# EAGLE design pcb-bldc-drive-triple (EAGLE 9.6.2)
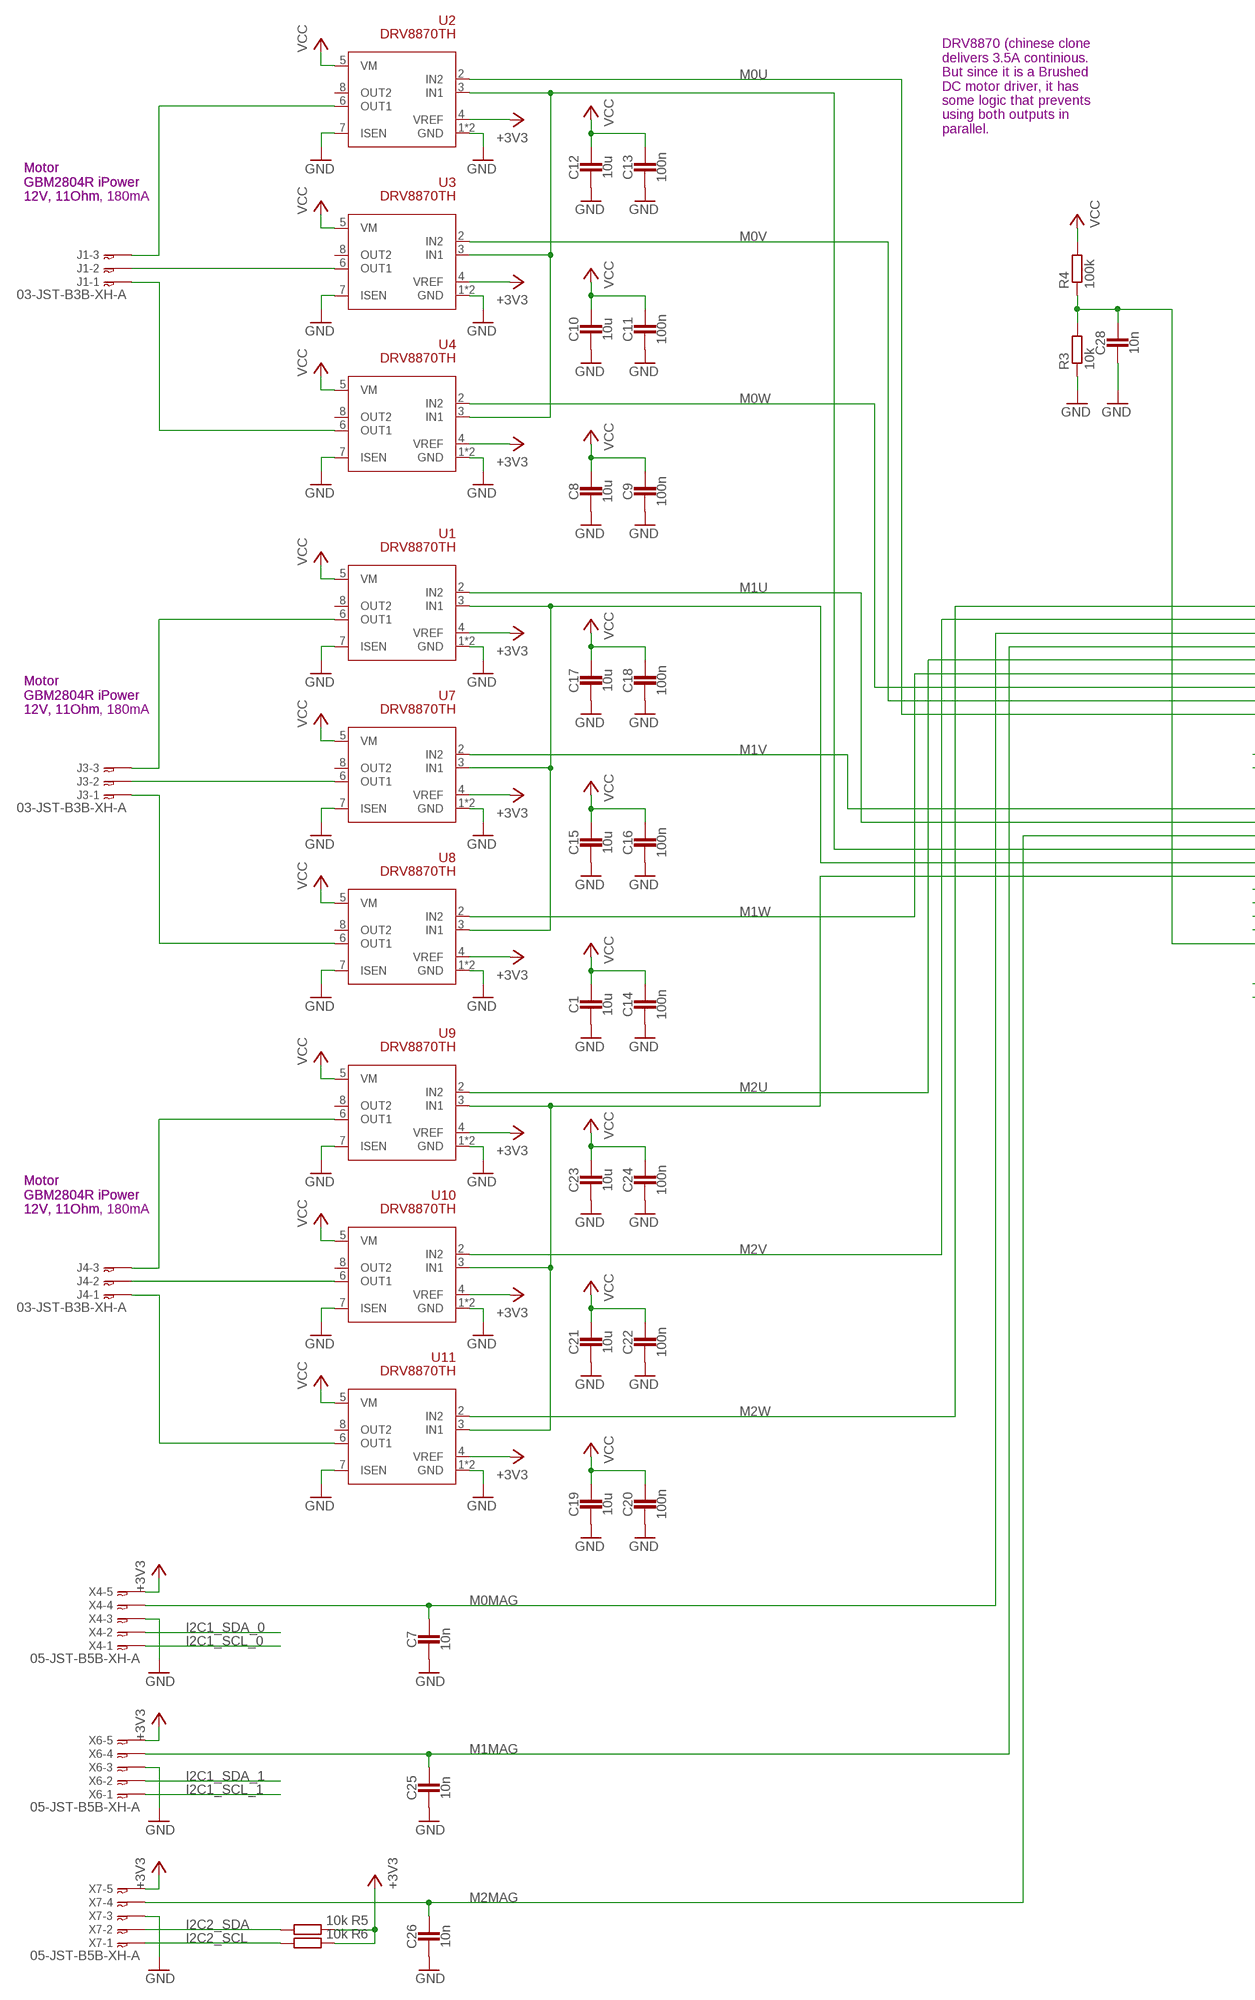
[diagram p0: schematic, sheet 1, part 1 of 2]
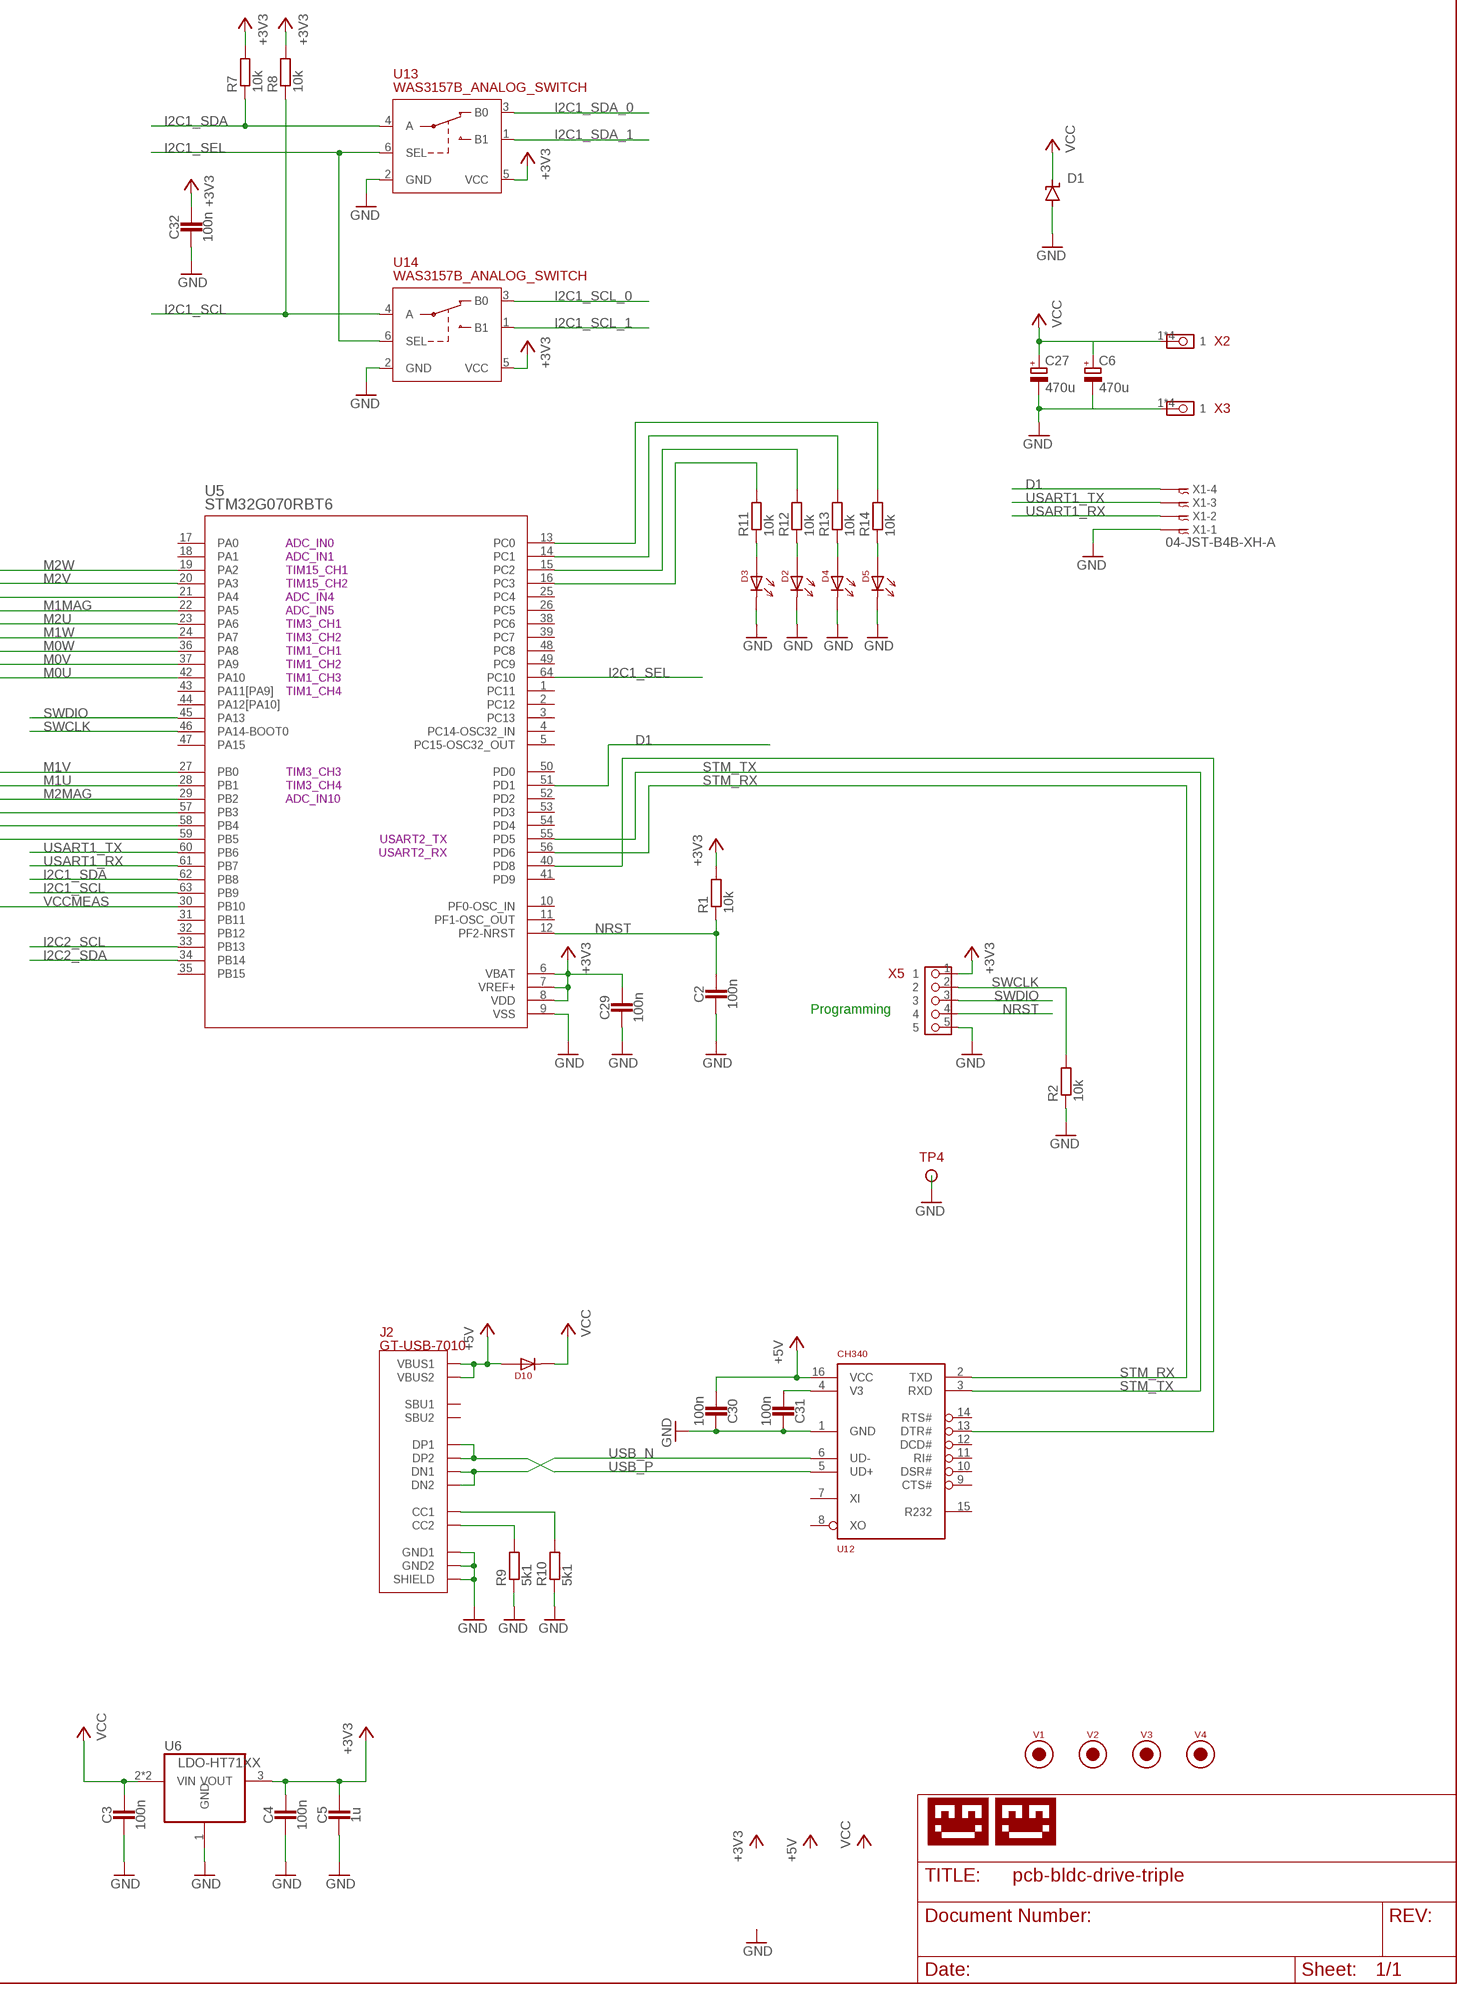
[diagram p1: schematic, sheet 1, part 2 of 2]

## Parts
C1  10u  CAPACITOR1206_CAP  [1206_CAP]
C2  100n  CAPACITOR0603_CAP  [0603_CAP]
C3  100n  CAPACITOR0603_CAP  [0603_CAP]
C4  100n  CAPACITOR0603_CAP  [0603_CAP]
C5  1u  CAPACITOR0603_CAP  [0603_CAP]
C6  470u  CPOL-EU153CLV-1010  [153CLV-1010]
C7  10n  CAPACITOR0603_CAP  [0603_CAP]
C8  10u  CAPACITOR1206_CAP  [1206_CAP]
C9  100n  CAPACITOR0603_CAP  [0603_CAP]
C10  10u  CAPACITOR1206_CAP  [1206_CAP]
C11  100n  CAPACITOR0603_CAP  [0603_CAP]
C12  10u  CAPACITOR1206_CAP  [1206_CAP]
C13  100n  CAPACITOR0603_CAP  [0603_CAP]
C14  100n  CAPACITOR0603_CAP  [0603_CAP]
C15  10u  CAPACITOR1206_CAP  [1206_CAP]
C16  100n  CAPACITOR0603_CAP  [0603_CAP]
C17  10u  CAPACITOR1206_CAP  [1206_CAP]
C18  100n  CAPACITOR0603_CAP  [0603_CAP]
C19  10u  CAPACITOR1206_CAP  [1206_CAP]
C20  100n  CAPACITOR0603_CAP  [0603_CAP]
C21  10u  CAPACITOR1206_CAP  [1206_CAP]
C22  100n  CAPACITOR0603_CAP  [0603_CAP]
C23  10u  CAPACITOR1206_CAP  [1206_CAP]
C24  100n  CAPACITOR0603_CAP  [0603_CAP]
C25  10n  CAPACITOR0603_CAP  [0603_CAP]
C26  10n  CAPACITOR0603_CAP  [0603_CAP]
C27  470u  CPOL-EU153CLV-1010  [153CLV-1010]
C28  10n  CAPACITOR0603_CAP  [0603_CAP]
C29  100n  CAPACITOR0603_CAP  [0603_CAP]
C30  100n  CAPACITOR0603_CAP  [0603_CAP]
C31  100n  CAPACITOR0603_CAP  [0603_CAP]
C32  100n  CAPACITOR0603_CAP  [0603_CAP]
D1  SUPPRESSOR-SMBJ  [SMBJ]
D2  LED-0805  [0805-DOT]
D3  LED-0805  [0805-DOT]
D4  LED-0805  [0805-DOT]
D5  LED-0805  [0805-DOT]
D10  DIODE-1206  [1206-DOT]
J1  03-JST-B3B-XH-A  [B3B-XH]
J2  GT-USB-7010  [GT-USB-7010]
J3  03-JST-B3B-XH-A  [B3B-XH]
J4  03-JST-B3B-XH-A  [B3B-XH]
R1  10k  RESISTOR0603_RES  [0603-RES]
R2  10k  RESISTOR0603_RES  [0603-RES]
R3  10k  RESISTOR0603_RES  [0603-RES]
R4  100k  RESISTOR0603_RES  [0603-RES]
R5  10k  RESISTOR0603_RES  [0603-RES]
R6  10k  RESISTOR0603_RES  [0603-RES]
R7  10k  RESISTOR0603_RES  [0603-RES]
R8  10k  RESISTOR0603_RES  [0603-RES]
R9  5k1  RESISTOR0603_RES  [0603-RES]
R10  5k1  RESISTOR0603_RES  [0603-RES]
R11  10k  RESISTOR0603_RES  [0603-RES]
R12  10k  RESISTOR0603_RES  [0603-RES]
R13  10k  RESISTOR0603_RES  [0603-RES]
R14  10k  RESISTOR0603_RES  [0603-RES]
TP4  TESTPIN1MM  [PIN-SMD-1X1-TEST_1M0]
U1  DRV8870TH  [SOIC-8-THERM]
U2  DRV8870TH  [SOIC-8-THERM]
U3  DRV8870TH  [SOIC-8-THERM]
U4  DRV8870TH  [SOIC-8-THERM]
U5  STM32G070RBT6  [LQFP-64]
U6  LDO-HT71XX  [SOT-89]
U7  DRV8870TH  [SOIC-8-THERM]
U8  DRV8870TH  [SOIC-8-THERM]
U9  DRV8870TH  [SOIC-8-THERM]
U10  DRV8870TH  [SOIC-8-THERM]
U11  DRV8870TH  [SOIC-8-THERM]
U12  CH340  [SOIC-16]
U13  WAS3157B_ANALOG_SWITCH  [SOT323-6]
U14  WAS3157B_ANALOG_SWITCH  [SOT323-6]
U$1  LOGO-TOBENG-1MM-FINISH  [TOBENG-1MM-FINISH]
U$2  LOGO-TOBENG-4MM-MASK  [TOBENG-4MM-MASK]
V1  FIDUCIAL2MM  [FIDUCIAL_2MM]
V2  FIDUCIAL2MM  [FIDUCIAL_2MM]
V3  FIDUCIAL2MM  [FIDUCIAL_2MM]
V4  FIDUCIAL2MM  [FIDUCIAL_2MM]
X1  04-JST-B4B-XH-A  [B4B-XH]
X2  PIN_1X1WELDINGTERMINAL  [XFCNTS34031]
X3  PIN_1X1WELDINGTERMINAL  [XFCNTS34031]
X4  05-JST-B5B-XH-A  [B5B-XH]
X5  PIN_5X1HD  [PIN_5X1_HD]
X6  05-JST-B5B-XH-A  [B5B-XH]
X7  05-JST-B5B-XH-A  [B5B-XH]

## Nets
+3V3: C4.1 C5.1 C29.1 C32.1 R1.2 R5.1 R6.1 R7.2 R8.2 U1.4(VREF) U2.4(VREF) U3.4(VREF) U4.4(VREF) U5.6(VBAT) U5.7(VREF+) U5.8(VDD) U6.3(VOUT) U7.4(VREF) U8.4(VREF) U9.4(VREF) U10.4(VREF) U11.4(VREF) U13.5(VCC) U14.5(VCC) X4.P$5 X5.1 X6.P$5 X7.P$5
+5V: C30.2 D10.1 J2.A4B9(VBUS1) J2.B4A9(VBUS2) U12.16(VCC)
D1: U5.51(PD1) X1.P$4
GND: C1.2 C2.2 C3.2 C4.2 C5.2 C6.- C7.2 C8.2 C9.2 C10.2 C11.2 C12.2 C13.2 C14.2 C15.2 C16.2 C17.2 C18.2 C19.2 C20.2 C21.2 C22.2 C23.2 C24.2 C25.2 C26.2 C27.- C28.2 C29.2 C30.1 C31.1 C32.2 D1.A D2.2 D3.2 D4.2 D5.2 J2.13(SHIELD) J2.14(SHIELD) J2.15(SHIELD) J2.16(SHIELD) J2.A1B12(GND1) J2.B1A12(GND2) R2.1 R3.1 R9.1 R10.1 TP4.1 U1.1(GND) U1.7(ISEN) U1.9(GND) U2.1(GND) U2.7(ISEN) U2.9(GND) U3.1(GND) U3.7(ISEN) U3.9(GND) U4.1(GND) U4.7(ISEN) U4.9(GND) U5.9(VSS) U6.1(GND) U7.1(GND) U7.7(ISEN) U7.9(GND) U8.1(GND) U8.7(ISEN) U8.9(GND) U9.1(GND) U9.7(ISEN) U9.9(GND) U10.1(GND) U10.7(ISEN) U10.9(GND) U11.1(GND) U11.7(ISEN) U11.9(GND) U12.1(GND) U13.2(GND) U14.2(GND) X1.P$1 X3.1 X3.2 X3.3 X3.4 X4.P$3 X5.5 X6.P$3 X7.P$3
I2C1_SCL: R8.1 U5.63(PB9) U14.4(A)
I2C1_SCL_0: U14.3(B0) X4.P$1
I2C1_SCL_1: U14.1(B1) X6.P$1
I2C1_SDA: R7.1 U5.62(PB8) U13.4(A)
I2C1_SDA_0: U13.3(B0) X4.P$2
I2C1_SDA_1: U13.1(B1) X6.P$2
I2C1_SEL: U5.64(PC10) U13.6(SEL) U14.6(SEL)
I2C2_SCL: R6.2 U5.33(PB13) X7.P$1
I2C2_SDA: R5.2 U5.34(PB14) X7.P$2
M0MAG: C7.1 U5.21(PA4) X4.P$4
M0U: U2.2(IN2) U5.42(PA10)
M0V: U3.2(IN2) U5.37(PA9)
M0W: U4.2(IN2) U5.36(PA8)
M1MAG: C25.1 U5.22(PA5) X6.P$4
M1U: U1.2(IN2) U5.28(PB1)
M1V: U5.27(PB0) U7.2(IN2)
M1W: U5.24(PA7) U8.2(IN2)
M2MAG: C26.1 U5.29(PB2) X7.P$4
M2U: U5.23(PA6) U9.2(IN2)
M2V: U5.20(PA3) U10.2(IN2)
M2W: U5.19(PA2) U11.2(IN2)
N$1: J2.B5(CC2) R9.2
N$2: J2.A5(CC1) R10.2
N$3 [power]: J1.P$2 U3.6(OUT1)
N$4 [power]: J1.P$3 U2.6(OUT1)
N$5: C31.2 U12.4(V3)
N$6 [power]: J3.P$3 U1.6(OUT1)
N$7 [power]: J1.P$1 U4.6(OUT1)
N$8: D3.1 R11.1
N$9 [power]: J3.P$2 U7.6(OUT1)
N$10 [power]: J3.P$1 U8.6(OUT1)
N$11: U5.59(PB5) U9.3(IN1) U10.3(IN1) U11.3(IN1)
N$12: U1.3(IN1) U5.58(PB4) U7.3(IN1) U8.3(IN1)
N$13 [power]: J4.P$3 U9.6(OUT1)
N$14: U2.3(IN1) U3.3(IN1) U4.3(IN1) U5.57(PB3)
N$15 [power]: J4.P$2 U10.6(OUT1)
N$16 [power]: J4.P$1 U11.6(OUT1)
N$17: D2.1 R12.1
N$18: D4.1 R13.1
N$19: D5.1 R14.1
N$20: R14.2 U5.13(PC0)
N$21: R13.2 U5.14(PC1)
N$22: R12.2 U5.15(PC2)
N$23: R11.2 U5.16(PC3)
N$74: U5.40(PD8) U12.13(DTR#)
NRST: C2.1 R1.1 U5.12(PF2-NRST) X5.4
STM_RX: U5.56(PD6) U12.2(TXD)
STM_TX: U5.55(PD5) U12.3(RXD)
SWCLK: R2.2 U5.46(PA14-BOOT0) X5.2
SWDIO: U5.45(PA13) X5.3
USART1_RX: U5.61(PB7) X1.P$2
USART1_TX: U5.60(PB6) X1.P$3
USB_N [usb]: J2.A7(DN1) J2.B7(DN2) U12.6(UD-)
USB_P [usb]: J2.A6(DP1) J2.B6(DP2) U12.5(UD+)
VCC [power]: C1.1 C3.1 C6.+ C8.1 C9.1 C10.1 C11.1 C12.1 C13.1 C14.1 C15.1 C16.1 C17.1 C18.1 C19.1 C20.1 C21.1 C22.1 C23.1 C24.1 C27.+ D1.C D10.2 R4.2 U1.5(VM) U2.5(VM) U3.5(VM) U4.5(VM) U6.2(VIN) U6.2@1(VIN) U7.5(VM) U8.5(VM) U9.5(VM) U10.5(VM) U11.5(VM) X2.1 X2.2 X2.3 X2.4
VCCMEAS: C28.1 R3.2 R4.1 U5.30(PB10)
Unconnected: J2.A8(SBU1) J2.B8(SBU2) U1.8(OUT2) U2.8(OUT2) U3.8(OUT2) U4.8(OUT2) U5.1(PC11) U5.2(PC12) U5.3(PC13) U5.4(PC14-OSC32_IN) U5.5(PC15-OSC32_OUT) U5.10(PF0-OSC_IN) U5.11(PF1-OSC_OUT) U5.17(PA0) U5.18(PA1) U5.25(PC4) U5.26(PC5) U5.31(PB11) U5.32(PB12) U5.35(PB15) U5.38(PC6) U5.39(PC7) U5.41(PD9) U5.43(PA11[PA9]) U5.44(PA12[PA10]) U5.47(PA15) U5.48(PC8) U5.49(PC9) U5.50(PD0) U5.52(PD2) U5.53(PD3) U5.54(PD4) U7.8(OUT2) U8.8(OUT2) U9.8(OUT2) U10.8(OUT2) U11.8(OUT2) U12.7(XI) U12.8(XO) U12.9(CTS#) U12.10(DSR#) U12.11(RI#) U12.12(DCD#) U12.14(RTS#) U12.15(R232)

## Notes on the sheet
- DRV8870 (chinese clone
  delivers 3.5A continious.
  But since it is a Brushed
  DC motor driver, it has
  some logic that prevents
  using both outputs in 
  parallel.
- Motor
  GBM2804R iPower
  12V, 11Ohm
- Motor
  GBM2804R iPower
  12V, 11Ohm, 180mA
- ADC_IN0
- ADC_IN1
- TIM15_CH1
- TIM15_CH2
- ADC_IN4
- ADC_IN5
- TIM3_CH1
- TIM3_CH2
- TIM1_CH1
- TIM1_CH2
- Motor
  GBM2804R iPower
  12V, 11Ohm
- Motor
  GBM2804R iPower
  12V, 11Ohm, 180mA
- TIM1_CH3
- TIM1_CH4
- TIM3_CH3
- TIM3_CH4
- ADC_IN10
- USART2_TX
- USART2_RX
- Programming
- Motor
  GBM2804R iPower
  12V, 11Ohm
- Motor
  GBM2804R iPower
  12V, 11Ohm, 180mA

## Library data of the parts
C1-C5 C7-C26 C28-C32 = passives:CAPACITOR: SMD Capacitor
C6 C27 = resistor:CPOL-EU: POLARIZED CAPACITOR, European symbol
D1 = diode:SUPPRESSOR-: Suppressor diode
D2-D5 = ftobler:LED
D10 = ftobler:DIODE
J1 J3 J4 = bt_con-jst-xh:03-JST: JST CONNECTOR
J2 = ftobler:GT-USB-7010
R1-R14 = passives:RESISTOR: Resistor Basic schematic elements and footprints for 0201, 0402, 0603, 1206, and PTH resistors.
TP4 = ftobler_backup:TESTPIN
U1-U4 U7-U11 = ftobler:DRV8870
U5 = stm32:STM32G070RBT6; COPYRIGHT: Copyright (C) 2024 Ultra Librarian. All rights reserved.; MANUFACTURER_PART_NUMBER: STM32G070RBT6; MFR_NAME: STMicroelectronics
U6 = ftobler:LDO
U12 = ftobler:CH340
U13 U14 = ftobler:WAS3157B_ANALOG_SWITCH
U$1 U$2 = ftobler:LOGO
V1-V4 = ftobler - Copy:FIDUCIAL
X1 = bt_con-jst-xh:04-JST: JST CONNECTOR
X2 X3 = ftobler-conn:PIN_1X1
X4 X6 X7 = bt_con-jst-xh:05-JST: JST CONNECTOR
X5 = ftobler-conn:PIN_5X1

## Net classes
1 usb: width 0.18 mm, clearance 0.2 mm to class 0, clearance 0.15 mm
2 power: width 0.15 mm, clearance 0.2 mm to class 0, clearance 0.2 mm to class 1, clearance 0.2 mm

## Board
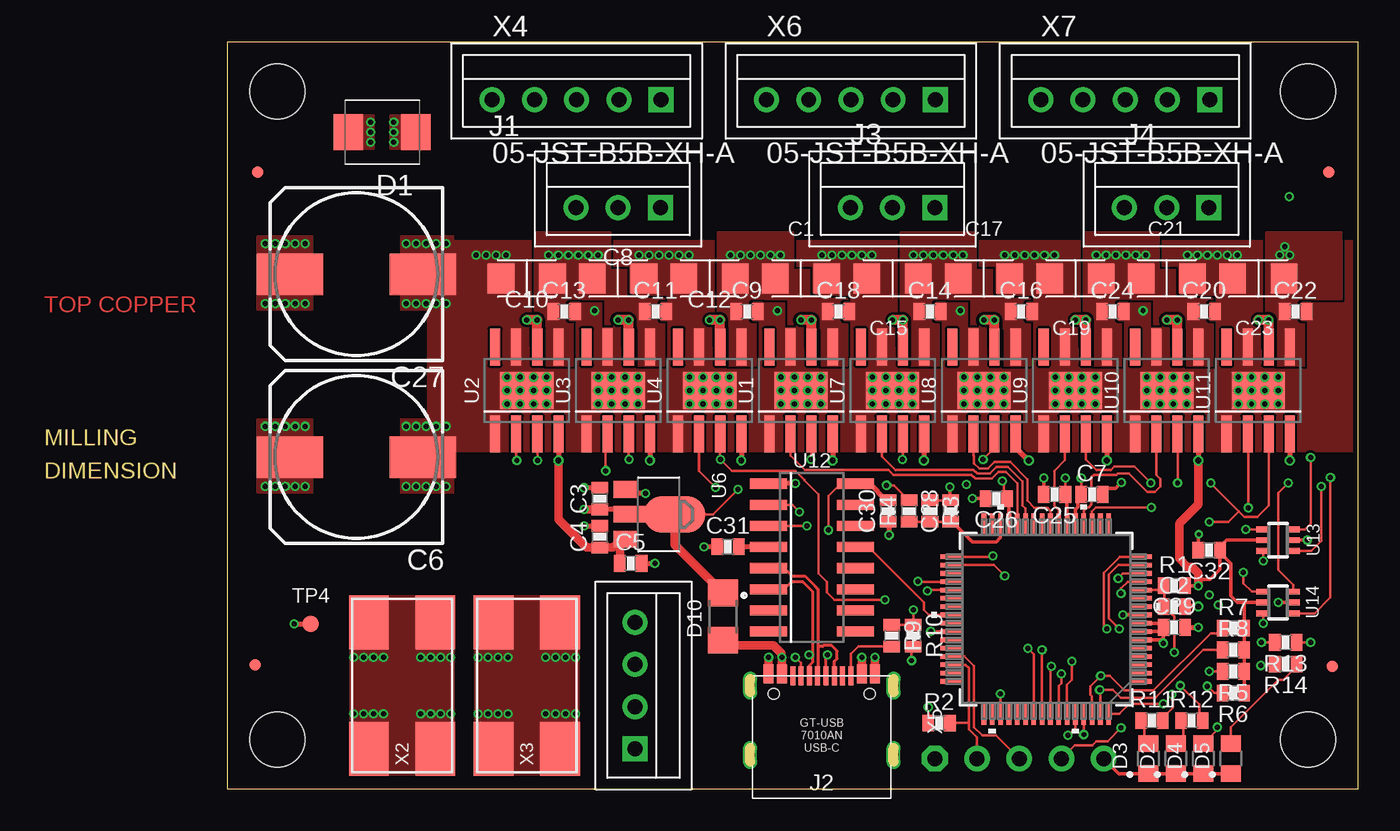
[diagram p2: board, top side]
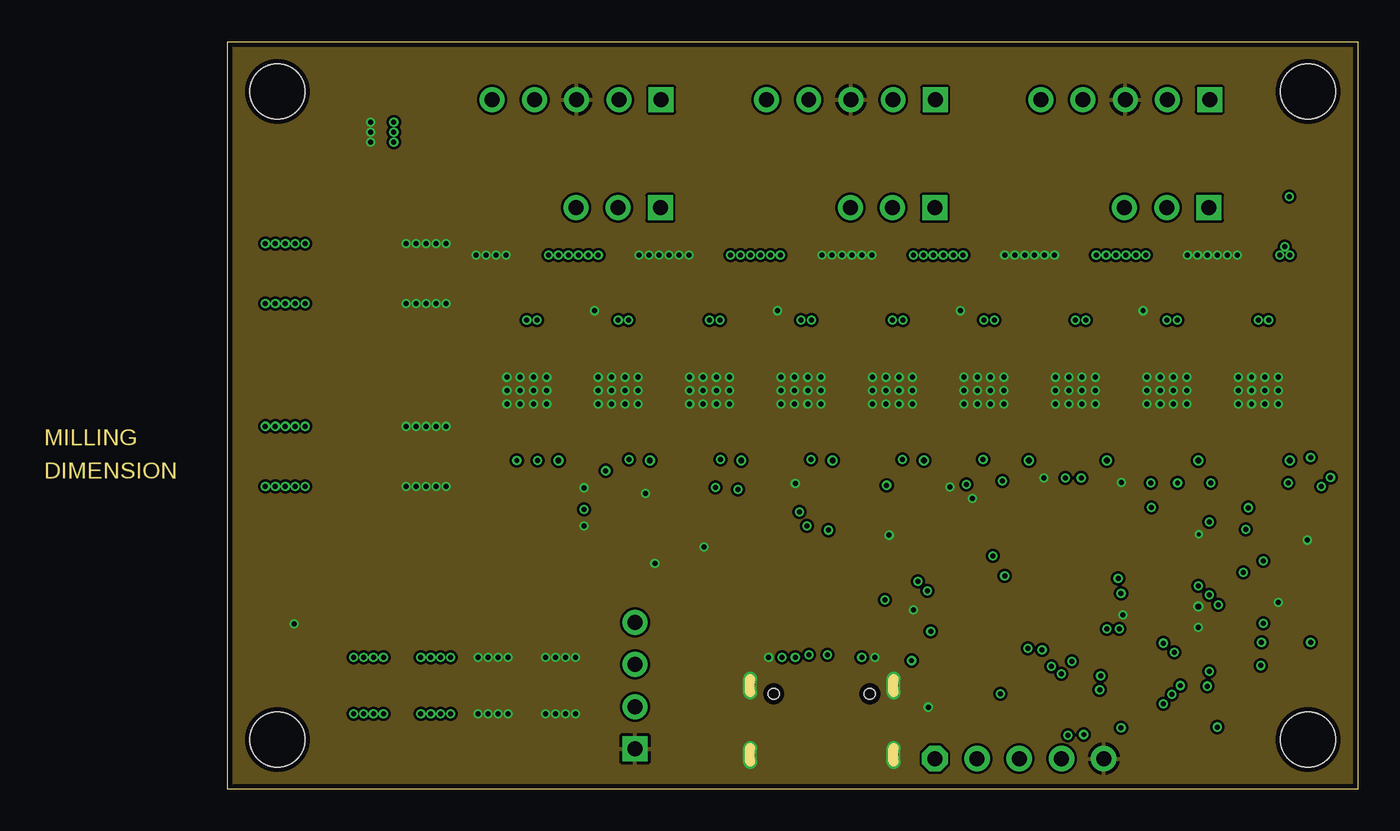
[diagram p3: board, inner layer Route2]
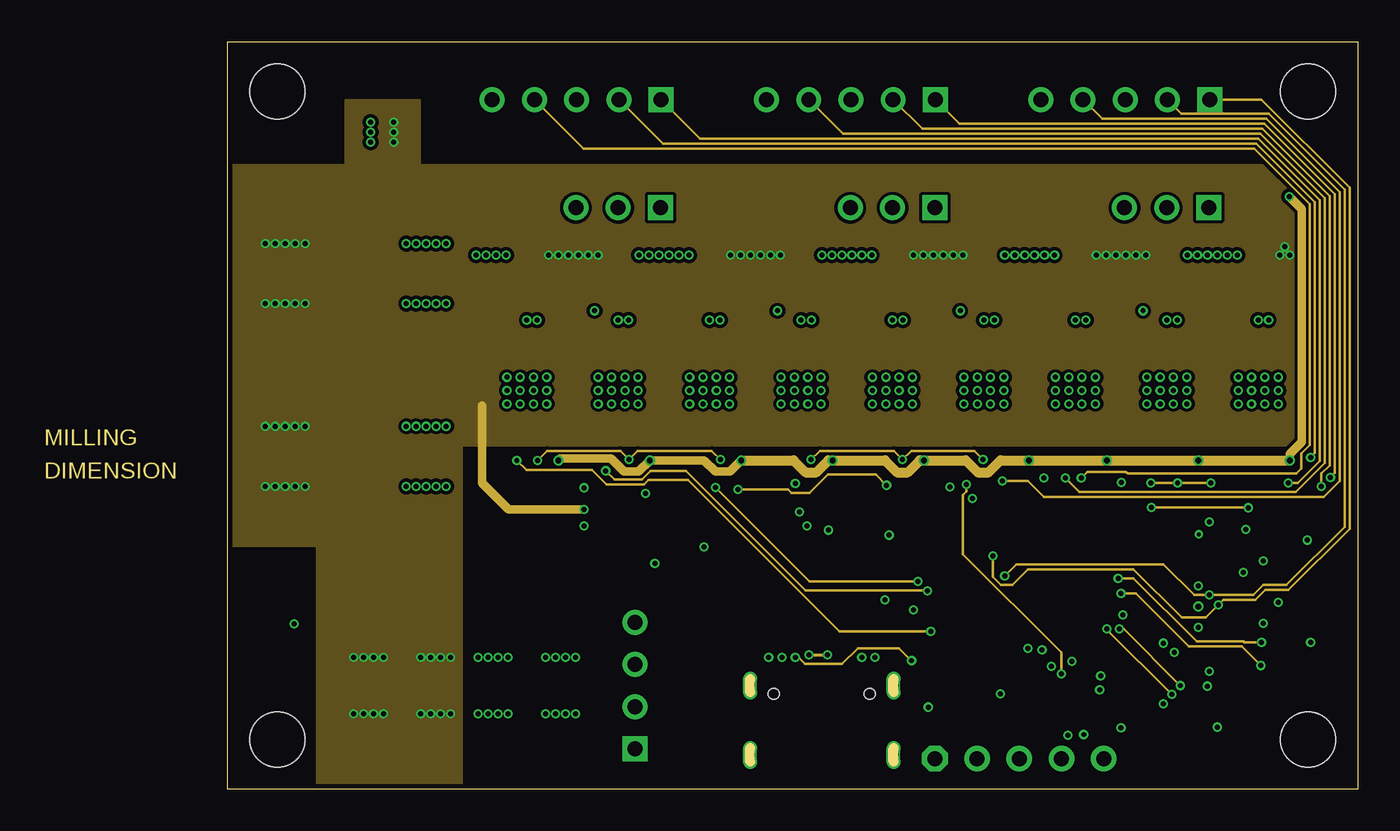
[diagram p4: board, inner layer Route15]
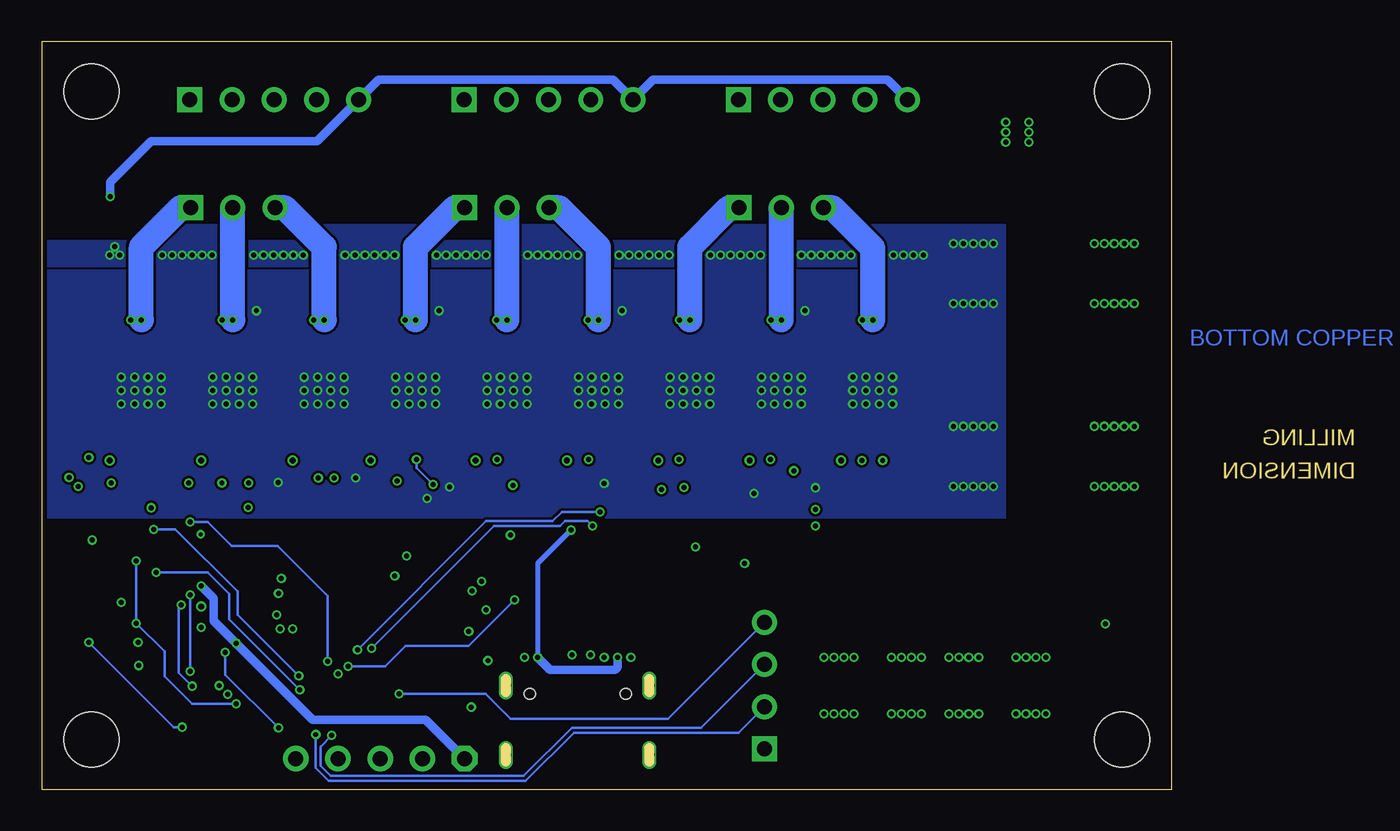
[diagram p5: board, bottom side, seen from below]

Size 68 x 45 mm. Coordinates in mm from the lower left corner, seen from the top.
Outline: 0,0 0,45 68,45 68,0 0,0
Copper layers (1+2*15+16): Top 0.035mm / dielectric 0.2mm / Route2 0.035mm / dielectric 0.4mm / Route15 0.035mm / dielectric 0.2mm / Bottom 0.035mm
Design rules "default *": minimum track width 0.15mm, minimum drill 0.2mm, track to track 0.15mm, track to pad 0.2mm, pad to pad 0.2mm, via to via 0.2mm, smd to smd 0.2mm, copper to edge 0.3mm, drill to drill 10mil, minimum pad ring 0.125mm, minimum via ring 0.125mm, stop-mask expansion 0.05mm, vias tented up to drill 0.35mm, thermal gap 0.2mm
Holes 3.3 mm at 3,42 65,42 65,3 3,3
tRestrict: area -0.3,38.7 to 6.3,45.3; area 61.7,38.7 to 68.3,45.3; area 61.7,-0.3 to 68.3,6.3; area -0.3,-0.3 to 6.3,6.3
bRestrict: area -0.3,38.7 to 6.3,45.3; area 61.7,38.7 to 68.3,45.3; area -0.3,-0.3 to 6.3,6.3; area 61.7,-0.3 to 68.3,6.3

### Footprints (pad centres in the part's own frame; a part is rotated, then mirrored left to right if it is on the bottom)
1206_CAP = smd 1.6 x 1.8: 1 -1.55,0; 2 1.55,0
0603_CAP = smd 0.7 x 1: 1 -0.65,0; 2 0.65,0
153CLV-1010 = smd 4 x 2.5: + 4,0; - -4,0
SMBJ = smd 1.78 x 2.16: A 2.04,0; C -2.03,0
0805-DOT = smd 1 x 1.2: 1 0.9,0; 2 -0.9,0
1206-DOT = smd 1.6 x 1.803: 1 -1.422,0; 2 1.422,0
B3B-XH = drill 0.9 pad 1.5 square: P$1 2.54,0 | drill 0.9 pad 1.5: P$2 0,0; P$3 -2.54,0
GT-USB-7010 = drill 0.6 pad 0.8 long: 13 -4.32,0; 14 -4.32,-4.18; 15 4.32,0; 16 4.32,-4.18 | smd 0.6 x 1.14: A1B12 -3.2,0.7; A4B9 -2.4,0.7; B1A12 3.2,0.7; B4A9 2.4,0.7 | smd 0.3 x 1.14: A5 -1.25,0.575; A6 -0.25,0.575; A7 0.25,0.575; A8 1.25,0.575; B5 1.75,0.575; B6 0.75,0.575; B7 -0.75,0.575; B8 -1.75,0.575 | hole 0.65: -2.89,-0.5; 2.89,-0.5
0603-RES = smd 0.7 x 1: 1 -0.65,0; 2 0.65,0
PIN-SMD-1X1-TEST_1M0 = smd 1 x 1: 1 0,0
SOIC-8-THERM = smd 0.61 x 2.21: 1 -1.905,-2.616; 2 -0.635,-2.616; 3 0.635,-2.616; 4 1.905,-2.616; 5 1.905,2.616; 6 0.635,2.616; 7 -0.635,2.616; 8 -1.905,2.616 | smd 3.2 x 2.2: 9 0,0
LQFP-64 = smd 1.302 x 0.279: 1 -5.706,3.75; 2 -5.706,3.25; 3 -5.706,2.75; 4 -5.706,2.25; 5 -5.706,1.75; 6 -5.706,1.25; 7 -5.706,0.75; 8 -5.706,0.25; 9 -5.706,-0.25; 10 -5.706,-0.75; 11 -5.706,-1.25; 12 -5.706,-1.75; 13 -5.706,-2.25; 14 -5.706,-2.75; 15 -5.706,-3.25; 16 -5.706,-3.75; 33 5.706,-3.75; 34 5.706,-3.25; 35 5.706,-2.75; 36 5.706,-2.25; 37 5.706,-1.75; 38 5.706,-1.25; 39 5.706,-0.75; 40 5.706,-0.25; 41 5.706,0.25; 42 5.706,0.75; 43 5.706,1.25; 44 5.706,1.75; 45 5.706,2.25; 46 5.706,2.75; 47 5.706,3.25; 48 5.706,3.75 | smd 0.279 x 1.302: 17 -3.75,-5.706; 18 -3.25,-5.706; 19 -2.75,-5.706; 20 -2.25,-5.706; 21 -1.75,-5.706; 22 -1.25,-5.706; 23 -0.75,-5.706; 24 -0.25,-5.706; 25 0.25,-5.706; 26 0.75,-5.706; 27 1.25,-5.706; 28 1.75,-5.706; 29 2.25,-5.706; 30 2.75,-5.706; 31 3.25,-5.706; 32 3.75,-5.706; 49 3.75,5.706; 50 3.25,5.706; 51 2.75,5.706; 52 2.25,5.706; 53 1.75,5.706; 54 1.25,5.706; 55 0.75,5.706; 56 0.25,5.706; 57 -0.25,5.706; 58 -0.75,5.706; 59 -1.25,5.706; 60 -1.75,5.706; 61 -2.25,5.706; 62 -2.75,5.706; 63 -3.25,5.706; 64 -3.75,5.706
SOT-89 = smd 1 x 1.5: 1 -1.499,-1.981; 3 1.499,-1.981 | smd 1 x 2: 2 0,-1.727 | smd 2.2 x 3.7: 2@1 0,0.94
SOIC-16 = smd 0.61 x 2.21: 1 -4.445,-2.616; 2 -3.175,-2.616; 3 -1.905,-2.616; 4 -0.635,-2.616; 5 0.635,-2.616; 6 1.905,-2.616; 7 3.175,-2.616; 8 4.445,-2.616; 9 4.445,2.616; 10 3.175,2.616; 11 1.905,2.616; 12 0.635,2.616; 13 -0.635,2.616; 14 -1.905,2.616; 15 -3.175,2.616; 16 -4.445,2.616
SOT323-6 = smd 0.35 x 0.8: 1 -0.65,-0.9; 2 0,-0.9; 3 0.65,-0.9; 4 0.65,0.9; 5 0,0.9; 6 -0.65,0.9
FIDUCIAL_2MM = smd 0.7 x 0.7: V 0,0
B4B-XH = drill 0.9 pad 1.5 square: P$1 3.81,0 | drill 0.9 pad 1.5: P$2 1.27,0; P$3 -1.27,0; P$4 -3.81,0
XFCNTS34031 = smd 3.25 x 2.4: 1 -3.8,2; 2 3.8,2; 3 3.8,-2; 4 -3.8,-2
B5B-XH = drill 0.9 pad 1.5 square: P$1 5.08,0 | drill 0.9 pad 1.5: P$2 2.54,0; P$3 0,0; P$4 -2.54,0; P$5 -5.08,0
PIN_5X1_HD = drill 0.9 pad 1.54 octagon: 1 0,0 | drill 0.9 pad 1.54: 2 0,-2.54; 3 0,-5.08; 4 0,-7.62; 5 0,-10.16

### Placement (x,y rotation side)
C1  34.5,30.75 0 top
C2  56.95,11 0 top
C3  22.4,17.5 90 top
C4  22.4,15.2 90 top
C5  24.25,13.6 0 top
C6  7.75,20 180 top
C7  52,17.75 0 top
C8  23.5,30.75 0 top
C9  31.25,28.75 0 top
C10  18,30.75 180 top
C11  25.75,28.75 0 top
C12  29,30.75 180 top
C13  20.25,28.75 0 top
C14  42.25,28.75 0 top
C15  40,30.75 180 top
C16  47.75,28.75 0 top
C17  45.5,30.75 0 top
C18  36.75,28.75 0 top
C19  51,30.75 180 top
C20  58.75,28.75 0 top
C21  56.5,30.75 0 top
C22  64.25,28.75 0 top
C23  62,30.75 180 top
C24  53.25,28.75 0 top
C25  49.75,17.75 180 top
C26  46.25,17.5 180 top
C27  7.75,31 180 top
C28  43.5,16.75 90 top
C29  56.95,9.75 0 top
C30  39.75,16.75 90 top
C31  30.1,14.6 0 top
C32  59.05,14.4 180 top
D1  9.3,39.55 180 top
D2  57.05,1.85 90 top
D3  55.4,1.85 90 top
D4  58.7,1.85 90 top
D5  60.35,1.85 90 top
D10  29.8,10.4 90 top
J1  23.5,35 0 top
J2  35.75,6.25 0 top
J3  40,35 0 top
J4  56.5,35 0 top
R1  56.95,12.25 0 top
R2  42.8,4 0 top
R3  42.25,16.75 270 top
R4  41,16.75 90 top
R5  60.5,7.1 180 top
R6  60.5,5.8 180 top
R7  60.5,9.7 0 top
R8  60.5,8.4 0 top
R9  39.95,9.25 270 top
R10  41.25,9.25 270 top
R11  55.6,4.15 0 top
R12  58,4.15 0 top
R13  63.65,8.85 180 top
R14  63.65,7.55 180 top
TP4  5,9.95 0 top
U1  34.5,24 0 top
U2  18,24 0 top
U3  23.5,24 0 top
U4  29,24 0 top
U5  49.25,10.25 180 top
U6  25.95,16.55 270 top
U7  40,24 0 top
U8  45.5,24 0 top
U9  51,24 0 top
U10  56.5,24 0 top
U11  62,24 0 top
U12  35.15,13.95 270 top
U13  63.2,15 90 top
U14  63.2,11.25 90 top
U$1  56.15,11 0 bottom
U$2  16.95,16.7 0 top
V1  1.8,37.15 90 top
V2  66.25,37.15 0 top
V3  66.45,7.4 0 top
V4  1.65,7.5 0 top
X1  24.5,6.25 270 top
X2  10.5,6.25 90 top
X3  18,6.25 90 top
X4  21,41.5 0 top
X5  42.55,1.85 90 top
X6  37.5,41.5 0 top
X7  54,41.5 0 top

### Tracks (layer width: path | path; a pad name or v marks a point on that pad's centre or on a via)
+3V3  (via drill 0.3 pad 0.45, 0.35 pad 0.45)
  Top 0.2: U5.8 56.05,10 C29.1 56.3,9.65 | U5.7 56.15,9.5 56.3,9.65 | U5.6 56.15,9 56.3,9.15 | 56.3,9.15 56.3,9.65 | R1.2 v58.4,12.25 | v56.3,8.8 56.3,9.15 | 59.7,14.05 C32.1 59.7,14.6 60.1,15 U13.5 | 59.7,14.05 59.7,13.25 59.1,12.65 58.4,12.65 | U14.5 61.15,11.25 | 61.15,11.25 60.75,11.25 60.35,11.65 60.35,13.6 59.9,14.05 59.7,14.05 | R6.1 R5.1 R8.2 R7.2 61.15,11.25
  Top 0.3: U6.3 23.7,15.05 23.6,14.95 | U2.4 v19.91,19.8 v19.9,19.8 | U11.4 v63.91,19.79 v63.9,19.79 | U10.4 v58.41,19.8 v58.4,19.8 | U9.4 v52.91,19.8 v52.9,19.8 | U8.4 47.41,20.58 v48.19,19.8 v48.2,19.8 | U7.4 v41.91,19.8 v41.9,19.8 | U1.4 v36.41,19.8 v36.4,19.8 | U4.4 v30.91,19.8 v30.9,19.8 | U3.4 v25.41,19.8 v25.4,19.8
  Top 0.5: C5.1 23.6,14.95 23.2,14.55 C4.1 21.6,14.55 19.9,16.25 v19.9,19.8 | v58.4,19.8 58.4,17.15 57.25,16 57.25,13.9 57.75,13.4 58,13.4 58.4,13 58.4,12.65 v58.4,12.25
  Route15 0.3: 63.88,19.8 v63.9,19.79
  Route15 0.5: v63.9,19.79 63.9,20.18 64.62,20.91 64.62,34.9 v63.86,35.66 | v30.9,19.8 30.23,19.12 29.35,19.12 28.68,19.8 v25.4,19.8 24.73,19.12 23.85,19.12 23.07,19.9 20,19.9 v19.9,19.8
  Route15 0.6: 63.88,19.8 v58.4,19.8 v52.9,19.8 v48.2,19.8 46.5,19.8 45.77,19.07 45.13,19.07 44.4,19.8 v41.9,19.8 41.65,19.8 40.92,19.07 40.28,19.07 39.55,19.8 v36.4,19.8 36.15,19.8 35.42,19.07 34.78,19.07 34.05,19.8 v30.9,19.8
  Bottom 0.5: v58.4,12.25 57.65,11.5 57.65,10.15 v56.3,8.8 51.7,4.2 44.9,4.2 X5.1 | X4.P$5 17.12,42.7 31.22,42.7 X6.P$5 33.62,42.7 47.72,42.7 X7.P$5 51.42,39 61.4,39 63.86,36.54 v63.86,35.66
+5V  (via drill 0.3, 0.3 pad 0.45)
  Top 0.15: 36.9,18.39 36.15,17.65 v36.15,15.6
  Top 0.3: C30.2 39.6,17.4 38.6,18.39 U12.16 36.9,18.39
  Top 0.5: J2.A4B9 v33.35,7.95 33.33,7.97 33.33,8.2 32.85,8.68 30.1,8.68 D10.1 | J2.B4A9 v38.15,7.95
  Bottom 0.3: v36.15,15.6 38.15,13.6 v38.15,7.95
  Bottom 0.5: v38.15,7.95 37.4,7.2 33.5,7.2 33.35,7.35 v33.35,7.95
D1  (via drill 0.3 pad 0.45)
  Top 0.15: U5.51 v46.5,5.75
  Bottom 0.15: v46.5,5.75 41.3,5.75 39.8,4.25 30.31,4.25 X1.P$4
GND  (via drill 0.25 pad 0.45, 0.3, 0.3 pad 0.45, 0.35 pad 0.45)
  Top 0.15: R2.1 v42.15,4.95 | R3.1 C28.2 | R9.1 R10.1 v41.25,10.8
  Top 0.2: C7.2 53,18.1 53.41,18.1 v53.77,18.46 | C25.2 v49.1,18.75 | C26.2 v44.8,17.5 | C28.2 43.45,17.45 v43.45,18.2 | U14.2 v63.2,11.25 | U13.2 v64.95,15 | C32.2 58.4,15.32 v58.42,15.35 | X5.5 53.61,0.95 D3.2 D2.2 D4.2 D5.2
  Top 0.25: U5.9 v53.85,10.5
  Top 0.3: C29.2 v58.4,9.75 | U6.1 24.22,17.8 v25.15,17.8 | v21.45,15.85 C4.2 | C5.2 v25.7,13.6 | v58.4,11 C2.2 | C3.2 v21.45,18.15 | C31.1 v28.65,14.6 | v34.15,18.4 v34.15,18.39 U12.1 | v4,9.95 TP4.1 | C30.1 39.8,16.05 v39.8,15.3
  Top 0.5: J2.B1A12 v38.95,7.95 | J2.A1B12 v32.55,7.95
  other vias: 14.95,32.15 15.55,32.15 16.15,32.15 16.75,32.15 24.75,32.15 25.35,32.15 25.95,32.15 26.55,32.15 27.15,32.15 27.75,32.15 35.75,32.15 36.35,32.15 36.95,32.15 37.55,32.15 38.15,32.15 38.75,32.15 46.75,32.15 47.35,32.15 47.95,32.15 48.55,32.15 49.15,32.15 49.75,32.15 57.75,32.15 58.35,32.15 58.95,32.15 59.55,32.15 60.15,32.15 60.75,32.15 18.4,24 17.6,24 18.4,23.2 17.6,23.2 16.8,23.2 16.8,24 16.8,24.8 17.6,24.8 18.4,24.8 19.2,24.8 19.2,24 19.2,23.2 23.9,24 23.1,24 23.9,23.2 23.1,23.2 22.3,23.2 22.3,24 22.3,24.8 23.1,24.8 23.9,24.8 24.7,24.8 24.7,24 24.7,23.2 29.4,24 28.6,24 29.4,23.2 28.6,23.2 27.8,23.2 27.8,24 27.8,24.8 28.6,24.8 29.4,24.8 30.2,24.8 30.2,24 30.2,23.2 34.9,24 34.1,24 34.9,23.2 34.1,23.2 33.3,23.2 33.3,24 33.3,24.8 34.1,24.8 34.9,24.8 35.7,24.8 35.7,24 35.7,23.2 40.4,24 39.6,24 40.4,23.2 39.6,23.2 38.8,23.2 38.8,24 38.8,24.8 39.6,24.8 40.4,24.8 41.2,24.8 41.2,24 41.2,23.2 45.9,24 45.1,24 45.9,23.2 45.1,23.2 44.3,23.2 44.3,24 44.3,24.8 45.1,24.8 45.9,24.8 46.7,24.8 46.7,24 46.7,23.2 51.4,24 50.6,24 51.4,23.2 50.6,23.2 49.8,23.2 49.8,24 49.8,24.8 50.6,24.8 51.4,24.8 52.2,24.8 52.2,24 52.2,23.2 56.9,24 56.1,24 56.9,23.2 56.1,23.2 55.3,23.2 55.3,24 55.3,24.8 56.1,24.8 56.9,24.8 57.7,24.8 57.7,24 57.7,23.2 62.4,24 61.6,24 62.4,23.2 61.6,23.2 60.8,23.2 60.8,24 60.8,24.8 61.6,24.8 62.4,24.8 63.2,24.8 63.2,24 63.2,23.2 22.07,28.8 33.08,28.8 44.08,28.8 55.08,28.8 13.15,21.85 12.55,21.85 11.95,21.85 11.35,21.85 10.75,21.85 13.15,18.23 12.55,18.23 11.95,18.23 11.35,18.23 10.75,18.23 13.15,29.23 12.55,29.23 11.95,29.23 11.35,29.23 10.75,29.23 13.15,32.85 12.55,32.85 11.95,32.85 11.35,32.85 10.75,32.85 16.88,4.55 16.27,4.55 15.68,4.55 15.07,4.55 20.93,4.55 20.32,4.55 19.73,4.55 19.12,4.55 16.88,7.95 16.27,7.95 15.68,7.95 15.07,7.95 20.93,7.95 20.32,7.95 19.73,7.95 19.12,7.95 8.6,40.15 8.6,39.55 8.6,38.95
  pour Route2 (rank 2): -1,46 71,46 71,-1 -1,-1
  pour Top (rank 2, no thermals): 12.05,33 68.75,33 68.75,20.35 12.05,20.35
  pour Bottom (rank 2, no thermals): 10.05,33.95 68.5,33.95 68.5,16.35 10.05,16.35
  pour Top (no thermals): 10.45,17.88 10.45,22.25 13.57,22.25 13.57,17.88
  pour Top (no thermals): 10.45,28.88 10.45,33.25 13.57,33.25 13.57,28.88
  pour Top (no thermals): 6.5,38.55 6.5,40.55 8.8,40.55 8.8,38.55
  pour Top (no thermals): 14.9,0.9 14.9,11.6 21.1,11.6 21.1,0.9
  pour Route2 (rank 2, no thermals): 30.05,7.8 41.15,7.8 41.15,1.1 30.05,1.1
I2C1_SCL  (via drill 0.3 pad 0.45)
  Top 0.15: U5.63 52.5,5.95 v52.46,5.99 53.26,5.99 53.75,5.5 55.4,5.5 55.5,5.5 55.8,5.5 58.7,8.4 R8.1 | v61.1,13.05 61.1,12.4 61.6,11.9 U14.4
  Bottom 0.15: v52.46,5.99 56.7,10.22 56.7,11.75 58,13.05 v61.1,13.05
I2C1_SCL_0  (via drill 0.3 pad 0.45)
  Top 0.15: U14.3 64.1,12.3 63.2,13.2 63.2,17.85 v63.8,18.45
  Route15 0.15: X4.P$1 28.43,39.15 62,39.15 65.7,35.45 65.7,19.75 64.4,18.45 v63.8,18.45
I2C1_SCL_1  (via drill 0.3 pad 0.45)
  Top 0.15: U14.1 65.4,10.6 66.35,11.55 v66.35,18.78
  Route15 0.15: X6.P$1 44.03,40.05 62.38,40.05 66.6,35.83 66.6,19.03 v66.35,18.78
I2C1_SDA  (via drill 0.3 pad 0.45)
  Top 0.15: U5.62 52,5.6 51.91,5.69 51.91,6.21 v52.52,6.83 53.07,6.83 53.95,5.95 55.7,5.95 59.15,9.4 59.75,9.4 59.85,9.5 R7.1 | U13.4 v61.25,15.65
  Bottom 0.15: v52.52,6.83 56.2,10.5 56.2,11.9 59.95,15.65 v61.25,15.65
I2C1_SDA_0  (via drill 0.3 pad 0.45)
  Top 0.15: U13.3 64.8,15.65 65.15,16 v65.15,19.98
  Route15 0.15: X4.P$2 26.19,38.85 61.88,38.85 65.4,35.33 65.4,20.23 v65.15,19.98
I2C1_SDA_1  (via drill 0.3 pad 0.45)
  Top 0.15: v65.8,18.23 65.8,14.95 65.2,14.35 U13.1
  Route15 0.15: X6.P$2 41.79,39.75 62.25,39.75 66.3,35.7 66.3,19.51 65.8,19.01 v65.8,18.23
I2C1_SEL  (via drill 0.3 pad 0.45)
  Top 0.15: U5.64 53.64,4.54 54.25,5.15 v56.3,5.15 | U13.6 v62.3,13.75 | U14.6 v62.3,10
  Bottom 0.15: v56.3,5.15 58.95,5.15 60.6,6.8 60.6,8.3 v62.3,10 v62.3,13.75
I2C2_SCL  (via drill 0.3 pad 0.45)
  Top 0.15: U5.33 46,14 v46.05,14.05 | R6.2 59.35,5.8 v58.94,6.21
  Route15 0.15: X7.P$1 62.2,41.5 67.5,36.2 67.5,15.68 63.82,12 62.42,12 61.82,11.4 59.9,11.4 v59.6,11.1 58.85,10.35 57.4,10.35 54.5,13.25 48.15,13.25 47.2,12.3 46.52,12.3 46.05,12.77 v46.05,14.05
  Bottom 0.15: v58.94,6.21 59.75,7.02 59.75,10.95 v59.6,11.1
I2C2_SDA  (via drill 0.3 pad 0.45)
  Top 0.15: v46.75,12.85 46.1,13.5 U5.34 | R5.2 v59.05,7.1
  Route15 0.15: X7.P$2 57.39,40.65 62.63,40.65 67.2,36.08 67.2,15.8 63.7,12.3 62.3,12.3 61.7,11.7 v59.05,11.7 58.15,11.7 56.3,13.55 47.45,13.55 v46.75,12.85
  Bottom 0.15: v59.05,7.1 v59.05,11.7
M0MAG  (via drill 0.3 pad 0.45)
  Top 0.15: 51.15,17.55 C7.1 v51.35,18.75
  Top 0.2: U5.21 51,16.85 51.15,17 51.15,17.55
  Route15 0.15: X4.P$4 21.41,38.55 61.76,38.55 65.1,35.21 65.1,20.71 64.6,20.21 64.6,19.3 64.3,19 54.16,19 54.05,19.11 51.71,19.11 v51.35,18.75
M0U  (via drill 0.3 pad 0.45)
  Top 0.15: U2.2 17.36,19.84 v17.4,19.8 | U5.42 v42.3,9.5
  Route15 0.15: v17.4,19.8 17.98,19.23 21.92,19.23 22.8,18.35 25.05,18.35 25.32,18.62 27.7,18.62 36.82,9.5 v42.3,9.5
M0V  (via drill 0.3 pad 0.45)
  Top 0.15: U3.2 22.75,21.27 v22.75,19.18 | U5.37 42.14,12 v42.09,11.95
  Route15 0.15: v42.09,11.95 42.07,11.97 34.77,11.97 27.57,19.18 25.45,19.18 24.92,18.65 23.27,18.65 v22.75,19.18
M0W  (via drill 0.3 pad 0.45)
  Top 0.15: U4.2 28.36,19.16 v29.35,18.18 | U5.36 41.54,12.5 v41.52,12.52
  Route15 0.15: v29.35,18.18 35,12.52 v41.52,12.52
M1MAG  (via drill 0.3 pad 0.45)
  Top 0.15: 50.5,17.65 C25.1 v50.4,18.75
  Top 0.2: U5.22 50.5,17.65
  Route15 0.15: X6.P$4 37.01,39.45 62.13,39.45 66,35.58 66,19.63 64.27,17.9 51.25,17.9 v50.4,18.75
M1U
  Top 0.15: U1.2 33.87,20.09 34.73,19.23 39.75,19.23 40.05,18.93 44.75,18.93 44.97,18.7 45.97,18.7 46.37,19.1 46.83,19.1 47.52,18.4 47.52,15.98 U5.28
M1V
  Top 0.15: U7.2 39.37,20.04 40.17,19.23 44.87,19.23 45.1,19 45.85,19 46.25,19.4 46.95,19.4 47.83,18.53 47.83,17.07 48,16.9 U5.27
M1W
  Top 0.15: U5.24 49.5,16.8 49.35,16.95 48.55,16.95 48.12,17.38 48.12,18.65 47.08,19.7 46.12,19.7 45.73,19.3 45.22,19.3 44.9,19.62 44.9,20.05 44.87,20.09 U8.2
M2MAG  (via drill 0.3 pad 0.45)
  Top 0.15: v46.6,18.55 46.7,18.45 46.7,17.7 47,17.4
  Top 0.2: U5.29 47,17.4 47,17.5 C26.1
  Route15 0.15: X7.P$4 52.61,40.35 62.5,40.35 66.9,35.95 66.9,18.55 65.95,17.6 49.1,17.6 48.15,18.55 v46.6,18.55
M2U
  Top 0.15: U5.23 50,16.8 49.73,17.07 49.73,19.18 50.37,19.82 U9.2
M2V
  Top 0.15: U5.20 51.5,16.8 51.67,16.98 51.81,16.98 51.98,17.14 51.98,18.79 52.11,18.93 53.46,18.93 53.55,19.01 54.21,19.01 55.32,17.9 55.78,17.9 56.1,18.22 56.1,18.68 55.87,18.91 U10.2
M2W  (via drill 0.3 pad 0.45)
  Top 0.15: U5.19 52,16.74 52.24,16.98 v55.58,16.98 | U11.2 61.4,21.35 v61.4,16.95
  Route15 0.15: v55.58,16.98 61.38,16.98 v61.4,16.95
N$1
  Top 0.15: J2.B5 37.5,8.15 37.95,8.6 R9.2
N$2  (via drill 0.3)
  Top 0.15: v34.15,7.95 34.5,7.6 J2.A5 | v41.15,7.75 41.15,8.6 R10.2
  Route15 0.15: v34.15,7.95 34.34,7.95 34.74,7.55 36.97,7.55 37.92,8.5 40.4,8.5 v41.15,7.75
N$3  (via drill 0.3 pad 0.45)
  Top 0.6: U3.6 24.14,28.25 v24.12,28.25 v23.5,28.25
  Bottom 1.5: J1.P$2 23.52,34.98 23.52,28.27 v23.5,28.25
N$4  (via drill 0.3 pad 0.45)
  Top 0.6: U2.6 18.62,26.62 v18.62,28.25 v18,28.25
  Bottom 1.5: J1.P$3 20.42,35 18,32.58 v18,28.25
N$5
  Top 0.3: U12.4 32.52,14.6 C31.2
N$6  (via drill 0.3 pad 0.45)
  Top 0.6: U1.6 35.13,28.25 v35.12,28.25 v34.5,28.25
  Bottom 1.5: J3.P$3 36.87,35 34.5,32.63 v34.5,28.25
N$7  (via drill 0.3 pad 0.45)
  Top 0.6: U4.6 29.64,28.25 v29.62,28.25 v29,28.25
  Bottom 1.5: J1.P$1 26.63,35 29,32.63 v29,28.25
N$8
  Top 0.15: R11.1 55.15,3.95 55.15,3 D3.1
N$9  (via drill 0.3 pad 0.45)
  Top 0.6: U7.6 40.63,28.25 v40.62,28.25 v40,28.25
  Bottom 1.5: v40,28.25 J3.P$2
N$10  (via drill 0.3 pad 0.45)
  Top 0.6: U8.6 46.13,28.25 v46.12,28.25 v45.5,28.25
  Bottom 1.5: J3.P$1 43.13,35 45.5,32.63 v45.5,28.25
N$11  (via drill 0.3)
  Top 0.15: U11.3 62.63,17.09 61.95,16.4 61.17,16.4 60.84,16.74 | v59.15,18.45 59.15,18.42 60.84,16.74 | U10.3 57.15,21.37 v57.15,18.45 | U9.3 51.63,19.85 52.26,19.23 53.14,19.23 53.36,19.44 54.56,19.44 v55.55,18.45 | 60.84,16.74 60.2,16.1 v59.05,16.1 | v50.8,7.7 50.8,6.6 50.5,6.3 U5.59
  Route15 0.15: v59.15,18.45 v57.15,18.45 v55.55,18.45
  Bottom 0.15: v59.05,16.1 58,16.1 56.55,14.65 53.8,14.65 50.8,11.65 v50.8,7.7
N$12  (via drill 0.3)
  Top 0.15: U8.3 46.13,20.54 v45.45,19.85 | U7.3 40.63,19.89 v40.6,19.85 | U1.3 35.13,19.89 v35.1,19.85 | U5.58 50,6.24 50.15,6.39 v50.15,6.95
  Route15 0.15: v45.45,19.85 44.92,20.38 41.12,20.38 v40.6,19.85 40.08,20.38 35.62,20.38 v35.1,19.85 | v44.45,18.35 44.45,17.93 44.25,17.73 44.25,14.15 50.15,8.25 v50.15,6.95
  Bottom 0.15: v45.45,19.85 45.45,19.35 v44.45,18.35
N$13  (via drill 0.3 pad 0.45)
  Top 0.6: U9.6 51.63,28.25 v51.62,28.25 v51,28.25
  Bottom 1.5: J4.P$3 53.37,35 51,32.63 v51,28.25
N$14  (via drill 0.3)
  Top 0.15: U2.3 18.64,19.82 v18.65,19.8 | U4.3 29.64,19.86 v29.65,19.85 30.35,19.15 34.18,19.15 34.7,18.63 34.7,18.6 35.55,17.75 35.55,13 36.05,12.5 36.05,11.85 36.5,11.4 v39.55,11.4 | U3.3 24.14,19.86 v24.15,19.85 | U5.57 49.5,7.41 v49.55,7.41
  Route15 0.15: v18.65,19.8 19.23,20.38 23.62,20.38 v24.15,19.85 24.68,20.38 29.12,20.38 v29.65,19.85
  Bottom 0.15: v49.55,7.41 47.34,7.41 46.1,8.65 42.3,8.65 v39.55,11.4
N$15  (via drill 0.3 pad 0.45)
  Top 0.6: U10.6 57.13,28.25 v57.12,28.25 v56.5,28.25
  Bottom 1.5: v56.5,28.25 J4.P$2
N$16  (via drill 0.3 pad 0.45)
  Top 0.6: U11.6 62.63,28.25 v62.62,28.25 v62,28.25
  Bottom 1.5: J4.P$1 59.63,35 62,32.63 v62,28.25
N$17
  Top 0.15: R12.1 57.5,4 57.5,3.2 D2.1
N$18  (via drill 0.3)
  Top 0.15: R13.1 v65.15,8.85 | D4.1 59.55,3.6 v59.55,3.75
  Bottom 0.15: v65.15,8.85 60.05,3.75 v59.55,3.75
N$19
  Top 0.15: D5.1 60.35,3.75 63.2,6.6 63.5,6.6 64.3,7.4 R14.1
N$20  (via drill 0.3)
  Top 0.15: U5.13 54.15,12.5 53.75,12.1 v53.75,11.8 | R14.2 62.9,7.45 v62.15,7.45
  Route15 0.15: v53.75,11.8 54.63,11.8 57.83,8.6 61,8.6 v62.15,7.45
N$21  (via drill 0.3)
  Top 0.15: R13.2 v62.2,8.85 | U5.14 53.87,13 v53.57,12.7
  Route15 0.15: v62.2,8.85 61.17,8.85 61.12,8.9 58.3,8.9 54.5,12.7 v53.57,12.7
N$22  (via drill 0.3)
  Top 0.15: R12.2 58.45,4.35 58.45,5.12 v57.33,6.25 | U5.15 53.59,13.5 53.02,12.93 53.02,10.31 53.45,9.88 53.45,9.85 v53.65,9.65
  Route15 0.15: v57.33,6.25 53.92,9.65 v53.65,9.65
N$23  (via drill 0.3)
  Top 0.15: R11.2 56.25,4.32 56.85,4.92 56.85,5.38 56.79,5.43 v56.79,5.72 | U5.16 53.67,14 52.7,13.03 52.7,9.85 v52.9,9.65
  Route15 0.15: v56.79,5.72 52.9,9.61 v52.9,9.65
N$74
  Top 0.15: U5.40 42.2,10.5 41.9,10.8 41.9,11.25 38.56,14.59 U12.13
NRST  (via drill 0.3, 0.3 pad 0.45)
  Top 0.15: U5.12 56.35,12 | 56.35,12 56.35,12.2 R1.1 | 56.35,12 56.35,11.05 C2.1 56.3,10.9 56.6,10.6 56.75,10.6 56.95,10.4 v56.95,8.25 | X5.4 50.97,2.65 52.03,2.65 52.28,2.9 52.95,2.9 v53.75,3.7
  Bottom 0.15: v53.75,3.7 56.95,6.9 v56.95,8.25
STM_RX  (via drill 0.3, 0.3 pad 0.45)
  Top 0.15: v49,8.4 U5.56 | U12.2 33.98,17.12 v34.4,16.7
  Bottom 0.15: v34.4,16.7 36.7,16.7 37.25,16.15 41.25,16.15 v49,8.4
STM_TX  (via drill 0.3, 0.3 pad 0.45)
  Top 0.15: U5.55 48.5,8.12 v48.14,8.49 | U12.3 v34.84,15.86 v34.85,15.85
  Bottom 0.15: v34.85,15.85 35.15,16.15 36.5,16.15 36.8,15.85 40.77,15.85 v48.14,8.49
SWCLK
  Top 0.15: U5.46 44.4,7.5 44.6,7.3 44.6,4 | X5.2 45.09,3.14 44.6,3.63 44.6,4 | R2.2 44.6,4
SWDIO
  Top 0.15: X5.3 46.23,3.25 45.4,3.25 44.9,3.75 44.9,7.42 44.32,8 U5.45
USART1_RX  (via drill 0.3)
  Top 0.15: U5.61 v51.5,3.3
  Bottom 0.15: v51.5,3.3 51.5,2.72 51.52,2.7 51.52,1.29 50.74,0.51 38.87,0.51 35.98,3.4 26.08,3.4 X1.P$2
USART1_TX  (via drill 0.3)
  Top 0.15: v50.55,3.25 51,3.7 U5.60
  Bottom 0.15: X1.P$3 28.32,3.7 36.1,3.7 38.99,0.81 50.61,0.81 51.23,1.42 51.23,2.58 v50.55,3.25
USB_N  (via drill 0.3 pad 0.45)
  Top 0.18: U12.6 33.48,12.04 33.95,12.52 34.59,12.52 35.2,11.9 35.2,8.1 | 35.2,8.1 35.2,7.66 35,7.46 J2.B7 | 35.2,8.1 v34.97,8.1 | J2.A7 36,8.01 v36.09,8.1
  Route15 0.18: v34.97,8.1 v36.09,8.1
USB_P
  Top 0.18: U12.5 33.48,13.31 33.95,12.85 34.72,12.85 35.36,12.21 | 35.36,12.21 | 35.36,12.21 35.53,12.04 35.53,8.6 | J2.A6 35.53,6.86 35.53,8.6 | J2.B6 36.5,7.71 36.66,7.87 36.66,8.33 36.33,8.66 35.86,8.66 35.8,8.6 35.53,8.6
VCC  (via drill 0.3 pad 0.45)
  Top 0.15: U6.2@1 29.2,16.55 v30.7,18.05 | R4.2 40.1,18.3 v39.65,18.3
  Top 0.2: U6.2@1 U6.2
  Top 0.3: U6.2 24.22,16.85 C3.1
  Top 0.5: C3.1 v21.45,16.85 | D10.2 26.89,14.73 U6.2@1
  Route15 0.15: v39.65,18.3 39,18.95 36.11,18.95 35.01,17.85 33.92,17.85 33.72,18.05 v30.7,18.05
  Route15 0.5: v21.45,16.85 16.9,16.85 15.3,18.45 15.3,23.1
  other vias: 19.3,32.15 19.9,32.15 20.5,32.15 21.1,32.15 21.7,32.15 22.3,32.15 30.25,32.15 30.85,32.15 31.45,32.15 32.05,32.15 32.65,32.15 33.25,32.15 41.25,32.15 41.85,32.15 42.45,32.15 43.05,32.15 43.65,32.15 44.25,32.15 52.25,32.15 52.85,32.15 53.45,32.15 54.05,32.15 54.65,32.15 55.25,32.15 63.3,32.15 63.9,32.15 4.67,29.23 4.08,29.23 3.48,29.23 2.88,29.23 2.27,29.23 4.67,32.85 4.08,32.85 3.48,32.85 2.88,32.85 2.27,32.85 4.67,21.85 4.08,21.85 3.48,21.85 2.88,21.85 2.27,21.85 4.67,18.23 4.08,18.23 3.48,18.23 2.88,18.23 2.27,18.23 9.38,4.55 8.78,4.55 8.18,4.55 7.58,4.55 13.43,4.55 12.82,4.55 12.22,4.55 11.62,4.55 9.38,7.95 8.78,7.95 8.18,7.95 7.58,7.95 13.43,7.95 12.82,7.95 12.22,7.95 11.62,7.95 63.6,32.65 10,39.55 10,38.95 10,40.15
  pour Top (no thermals): 18.5,33.5 23,33.5 23,29.5 20.75,29.5 20.75,25.5 18.5,25.5
  pour Top (no thermals): 29.5,33.5 34,33.5 34,29.5 31.75,29.5 31.75,25.5 29.5,25.5
  pour Top (no thermals): 40.5,33.5 45,33.5 45,29.5 42.75,29.5 42.75,25.5 40.5,25.5
  pour Top (no thermals): 51.5,33.5 56,33.5 56,29.5 53.75,29.5 53.75,25.5 51.5,25.5
  pour Top (no thermals): 62.5,33.5 67,33.5 67,29.5 64.75,29.5 64.75,25.5 62.5,25.5
  pour Top (no thermals): 24.75,25.5 26.25,25.5 26.25,29.5 24.5,29.5 24.5,31.25 22.75,31.25 22.75,27.75 24.75,27.75
  pour Top (no thermals): 35.75,25.5 37.25,25.5 37.25,29.5 35.5,29.5 35.5,31.25 33.75,31.25 33.75,27.75 35.75,27.75
  pour Top (no thermals): 46.75,25.5 48.25,25.5 48.25,29.5 46.5,29.5 46.5,31.25 44.75,31.25 44.75,27.75 46.75,27.75
  pour Top (no thermals): 57.75,25.5 59.25,25.5 59.25,29.5 57.5,29.5 57.5,31.25 55.75,31.25 55.75,27.75 57.75,27.75
  pour Route15: -0.7,37.55 65.75,37.55 65.75,20.7 -0.7,20.7
  pour Top (no thermals): 1.82,17.88 1.82,22.25 5.08,22.25 5.08,17.88
  pour Top (no thermals): 1.82,28.88 1.82,33.25 5.08,33.25 5.08,28.88
  pour Route15: -1.1,14.65 -1.1,34 7.5,34 7.5,14.65
  pour Bottom: 18.35,33 23.35,33 23.35,31.5 18.35,31.5
  pour Bottom: 28.9,33 34.45,33 34.45,31.5 28.9,31.5
  pour Bottom: 40.15,33 45.35,33 45.35,31.5 40.15,31.5
  pour Bottom: 51.25,33 56.1,33 56.1,31.5 51.25,31.5
  pour Bottom: 61.9,33 67.9,33 67.9,31.5 61.9,31.5
  pour Top (no thermals): 9.8,40.55 11.4,40.55 11.4,38.55 9.8,38.55
  pour Top (no thermals): 7.4,11.6 13.6,11.6 13.6,0.9 7.4,0.9
  pour Route15: 5.4,-5.25 5.4,21.7 14.07,21.7 14.07,-5.25
  pour Route15: 11.55,33.55 7.1,33.55 7.1,41.48 11.55,41.48
VCCMEAS
  Top 0.15: R4.1 R3.2 C28.1
  Top 0.2: C28.1 43.6,16.1 44.8,14.9 46.25,14.9 46.5,15.15 U5.30

### Text on the board
Top: TOP COPPER
Bottom: BOTTOM COPPER
Dimension: DIMENSION
tStop: V1 | V2 | TOP MASK | V4 | V3
bStop: BOTTOM MASK
tFinish: 3V3 | MAG | GND | SDA | SCL | M0 | M1 | M2 | UVW | UVW | UVW | TOP SILK | JLCJLCJLCJLC | D1 | TX | RX | GND | 3 | C | D | R | G
bFinish: BOTTOM SILK | pcb-bldc-servo v2 / by ftobler 2024
Milling: MILLING